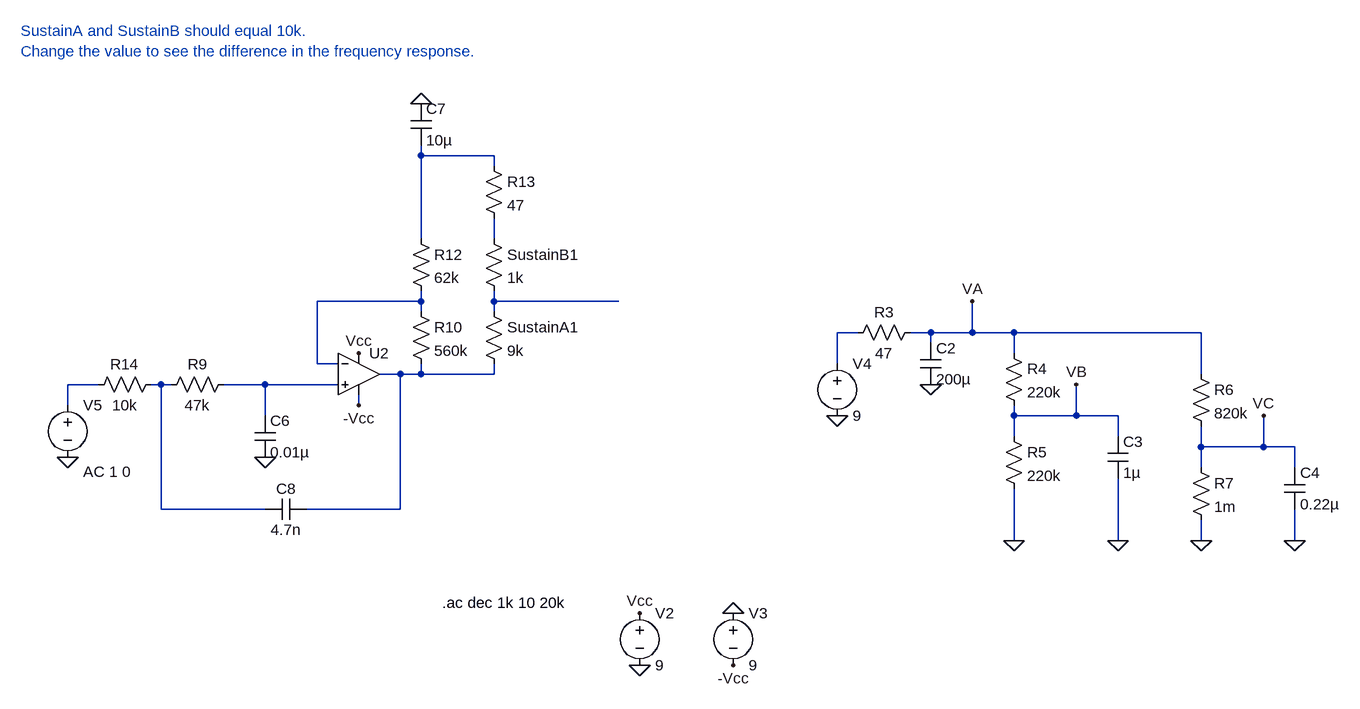
[diagram p0: schematic op_amp2.asc]
op_amp2.asc, the LTspice schematic file:
Version 4
SHEET 1 3044 724
WIRE 288 -384 288 -400
WIRE 400 -384 288 -384
WIRE 400 -368 400 -384
WIRE 288 -256 288 -384
WIRE 400 -256 400 -288
WIRE 288 -160 288 -176
WIRE 288 -160 128 -160
WIRE 400 -160 400 -176
WIRE 592 -160 400 -160
WIRE 288 -144 288 -160
WIRE 400 -144 400 -160
WIRE 960 -112 928 -112
WIRE 1072 -112 1040 -112
WIRE 1136 -112 1136 -160
WIRE 1136 -112 1072 -112
WIRE 1200 -112 1136 -112
WIRE 1488 -112 1200 -112
WIRE 1072 -96 1072 -112
WIRE 1200 -80 1200 -112
WIRE 128 -64 128 -160
WIRE 160 -64 128 -64
WIRE 928 -64 928 -112
WIRE 256 -48 224 -48
WIRE 288 -48 288 -64
WIRE 288 -48 256 -48
WIRE 400 -48 400 -64
WIRE 400 -48 288 -48
WIRE 1488 -48 1488 -112
WIRE -208 -32 -256 -32
WIRE -112 -32 -128 -32
WIRE -96 -32 -112 -32
WIRE 48 -32 -16 -32
WIRE 160 -32 48 -32
WIRE -256 0 -256 -32
WIRE 192 0 192 -16
WIRE 48 16 48 -32
WIRE 1200 16 1200 0
WIRE 1296 16 1296 -32
WIRE 1296 16 1200 16
WIRE 1360 16 1296 16
WIRE 1200 48 1200 16
WIRE 1360 48 1360 16
WIRE 1488 64 1488 32
WIRE 1584 64 1584 16
WIRE 1584 64 1488 64
WIRE 1632 64 1584 64
WIRE 1488 96 1488 64
WIRE 1632 96 1632 64
WIRE -112 160 -112 -32
WIRE 48 160 -112 160
WIRE 256 160 256 -48
WIRE 256 160 112 160
WIRE 1200 208 1200 128
WIRE 1360 208 1360 112
WIRE 1488 208 1488 176
WIRE 1632 208 1632 160
FLAG 624 400 0
FLAG 768 320 0
FLAG 624 320 Vcc
FLAG 768 400 -Vcc
FLAG 928 16 0
FLAG 1072 -32 0
FLAG 1136 -160 VA
FLAG 1296 -32 VB
FLAG 1200 208 0
FLAG 1360 208 0
FLAG 1488 208 0
FLAG 1632 208 0
FLAG 1584 16 VC
FLAG -256 80 0
FLAG 192 0 -Vcc
FLAG 192 -80 Vcc
FLAG 48 80 0
FLAG 288 -464 0
SYMBOL voltage 624 304 R0
SYMATTR InstName V2
SYMATTR Value 9
SYMBOL voltage 768 304 R0
SYMATTR InstName V3
SYMATTR Value 9
SYMBOL voltage 928 -80 R0
SYMATTR InstName V4
SYMATTR Value 9
SYMBOL res 1056 -128 R90
WINDOW 0 0 56 VBottom 2
WINDOW 3 32 56 VTop 2
SYMATTR InstName R3
SYMATTR Value 47
SYMBOL cap 1056 -96 R0
SYMATTR InstName C2
SYMATTR Value 200µ
SYMBOL res 1184 -96 R0
SYMATTR InstName R4
SYMATTR Value 220k
SYMBOL res 1184 32 R0
SYMATTR InstName R5
SYMATTR Value 220k
SYMBOL cap 1344 48 R0
SYMATTR InstName C3
SYMATTR Value 1µ
SYMBOL res 1472 -64 R0
SYMATTR InstName R6
SYMATTR Value 820k
SYMBOL res 1472 80 R0
SYMATTR InstName R7
SYMATTR Value 1m
SYMBOL cap 1616 96 R0
SYMATTR InstName C4
SYMATTR Value 0.22µ
SYMBOL OpAmps/UniversalOpAmp 192 -48 R0
SYMATTR InstName U2
SYMBOL voltage -256 -16 R0
WINDOW 123 24 118 Left 2
SYMATTR Value2 AC 1 0
SYMATTR InstName V5
SYMATTR Value ""
SYMBOL res 0 -48 R90
WINDOW 0 0 56 VBottom 2
WINDOW 3 32 56 VTop 2
SYMATTR InstName R9
SYMATTR Value 47k
SYMBOL cap 32 16 R0
SYMATTR InstName C6
SYMATTR Value 0.01µ
SYMBOL res 272 -160 R0
SYMATTR InstName R10
SYMATTR Value 560k
SYMBOL res 272 -272 R0
SYMATTR InstName R12
SYMATTR Value 62k
SYMBOL res 384 -160 R0
SYMATTR InstName SustainA1
SYMATTR Value 9k
SYMBOL res 384 -272 R0
SYMATTR InstName SustainB1
SYMATTR Value 1k
SYMBOL res 384 -384 R0
SYMATTR InstName R13
SYMATTR Value 47
SYMBOL cap 272 -464 R0
SYMATTR InstName C7
SYMATTR Value 10µ
SYMBOL res -112 -48 R90
WINDOW 0 0 56 VBottom 2
WINDOW 3 32 56 VTop 2
SYMATTR InstName R14
SYMATTR Value 10k
SYMBOL cap 112 144 R90
WINDOW 0 0 32 VBottom 2
WINDOW 3 32 32 VTop 2
SYMATTR InstName C8
SYMATTR Value 4.7n
TEXT 320 304 Left 2 !.ac dec 1k 10 20k
TEXT -328 -576 Left 2 ;SustainA and SustainB should equal 10k.\nChange the value to see the difference in the frequency response.

The netlist it stands for:
* op_amp2.asc
V2 Vcc 0 9
V3 0 -Vcc 9
V4 N005 0 9
R3 VA N005 47
C2 VA 0 200µ
R4 VA VB 220k
R5 VB 0 220k
C3 VB 0 1µ
R6 VA VC 820k
R7 VC 0 1m
C4 VC 0 0.22µ
XU2 N009 N003 Vcc -Vcc N006 level1 Avol=1Meg GBW=10Meg Vos=0 En=0 Enk=0 In=0 Ink=0 Rin=500Meg  ; pins In+ In- V+ V- OUT
V5 N007 0 AC 1 0
R9 N009 N008 47k
C6 N009 0 0.01µ
R10 N003 N006 560k
R12 N001 N003 62k
R§SustainA1 N004 N006 9k
R§SustainB1 N002 N004 1k
R13 N001 N002 47
C7 0 N001 10µ
R14 N008 N007 10k
C8 N006 N008 4.7n
.ac dec 1k 10 20k
* SustainA and SustainB should equal 10k.
* Change the value to see the difference in the frequency response.
.lib UniversalOpAmp1.lib
.backanno
.end